# EAGLE design cyclops (EAGLE 7.5.0)
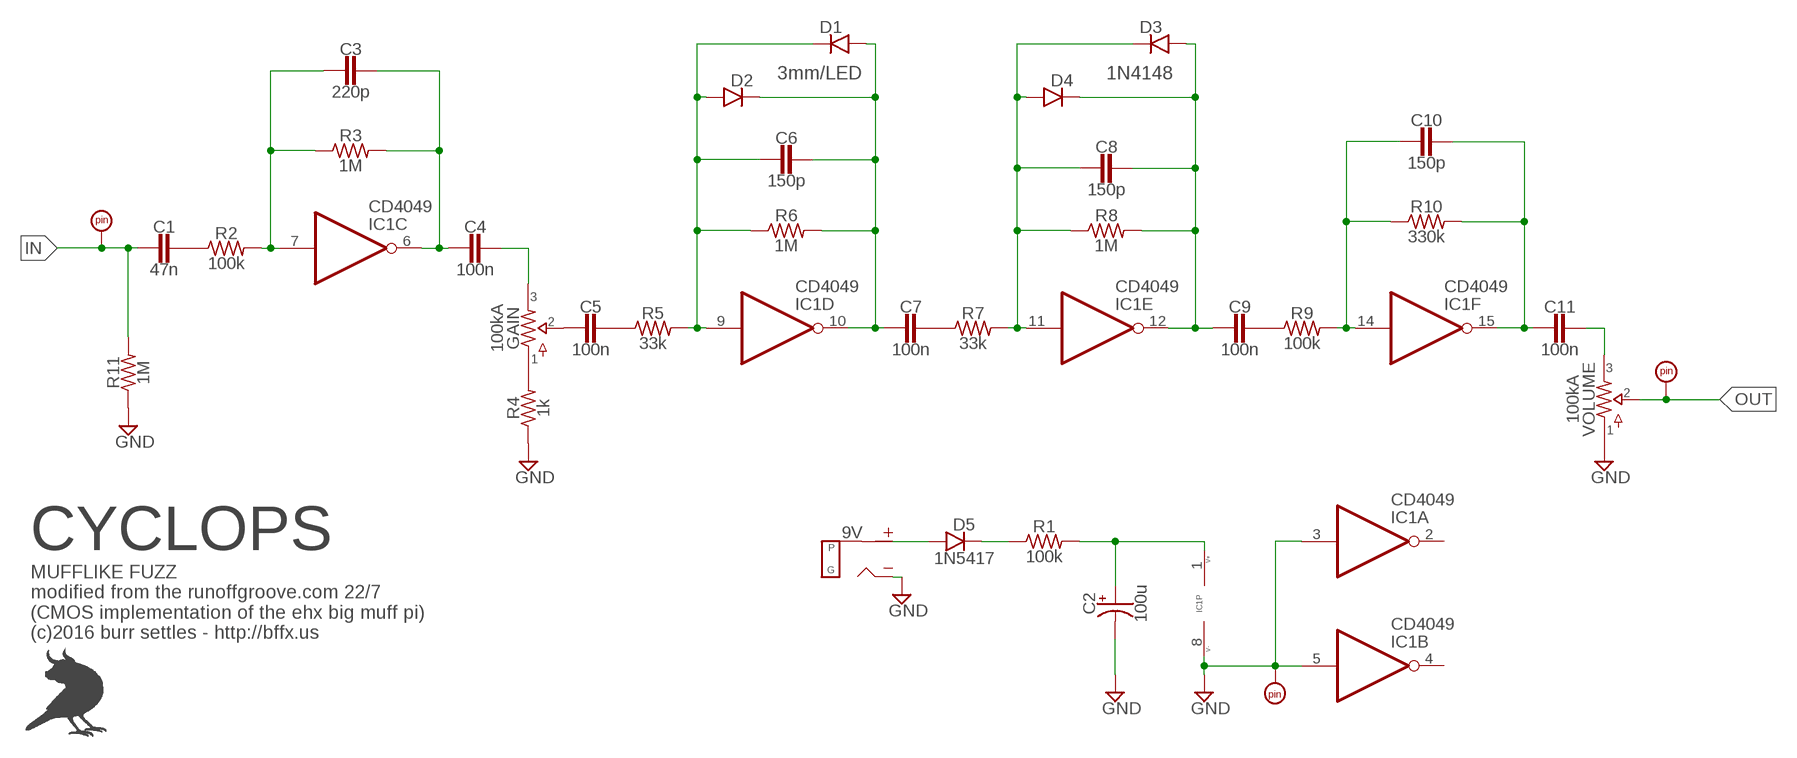
[diagram p0: schematic, sheet 1]

## Parts
9V  DC_MONO  [DC]
C1  47n  CER/FILM2  [050X030_025_2]
C2  100u  0631  [063_025]
C3  220p  CER/FILM2  [050X030_025_2]
C4  100n  CER/FILM2  [050X030_025_2]
C5  100n  CER/FILM2  [050X030_025_2]
C6  150p  CER/FILM2  [050X030_025_2]
C7  100n  CER/FILM2  [050X030_025_2]
C8  150p  CER/FILM2  [050X030_025_2]
C9  100n  CER/FILM2  [050X030_025_2]
C10  150p  CER/FILM2  [050X030_025_2]
C11  100n  CER/FILM2  [050X030_025_2]
D1  DO41.2  [DO41-2]
D2  DO41.2  [DO41-2]
D3  DO41.2  [DO41-2]
D4  DO41.2  [DO41-2]
D5  1N5417  DO41.3  [DO41-3]
GAIN  100kA  POTSTRIM  [2262_TRIM]
GND  PADRND  [ROUND]
IC1  CD4049  CD4049UBE  [DIL16]
IN  PADSQR  [SQUARE]
OUT  PADSQR  [SQUARE]
R1  100k  R_.2  [R0207/2V]
R2  100k  R_.2  [R0207/2V]
R3  1M  R_.2  [R0207/2V]
R4  1k  R_.2  [R0207/2V]
R5  33k  R_.2  [R0207/2V]
R6  1M  R_.2  [R0207/2V]
R7  33k  R_.2  [R0207/2V]
R8  1M  R_.2  [R0207/2V]
R9  100k  R_.2  [R0207/2V]
R10  330k  R_.2  [R0207/2V]
R11  1M  R_.2  [R0207/2V]
VOLUME  100kA  POTSSMALL_PADS  [PADS_SMALL]

## Nets
GND: 9V.S(SLEEVE) C2.- GND.1 IC1.3(A:I) IC1.5(B:I) IC1.8(P:VSS) R4.1 R11.1 VOLUME.1
IN: C1.2 IN.1 R11.2
N$1: C3.1 C4.2 IC1.6(C:O) R3.2
N$2: C5.2 GAIN.2
N$3: C3.2 IC1.7(C:I) R2.2 R3.1
N$4: C1.1 R2.1
N$5: C5.1 R5.1
N$6: C6.2 D1.C D2.A IC1.9(D:I) R5.2 R6.1
N$7: C6.1 C7.2 D1.A D2.C IC1.10(D:O) R6.2
N$8: C7.1 R7.1
N$9: C8.2 D3.C D4.A IC1.11(E:I) R7.2 R8.1
N$10: C4.1 GAIN.3
N$11: C8.1 C9.2 D3.A D4.C IC1.12(E:O) R8.2
N$12: C9.1 R9.1
N$13: C10.2 IC1.14(F:I) R9.2 R10.1
N$14: C10.1 C11.2 IC1.15(F:O) R10.2
N$15: GAIN.1 R4.2
N$16: C11.1 VOLUME.3
N$17: 9V.T(TIP) D5.A
N$18: C2.+ IC1.1(P:VDD) R1.2
N$21: D5.C R1.1
OUT: OUT.1 VOLUME.2
Unconnected: IC1.2(A:O) IC1.4(B:O)

## Notes on the sheet
- 3mm/LED | 1N4148
- CYCLOPS
- MUFFLIKE FUZZ
  modified from the runoffgroove.com 22/7
  (CMOS implementation of the ehx big muff pi)
  (c)2016 burr settles - http://bffx.us

## Library data of the parts
9V = jacks:DC_MONO
C1 C3-C11 = capacitors-film:CER/FILM: 47 - 120pF Xicon Ceramic Disc 2.5mm lead spacing
C2 = capacitors-elec:063: 33 - 220uF Xicon values at Mouser.com 10V: 220uF; 16V: 100uF; 25V: 100uF; 50V: 33uF
D1-D5 = diodes:DO41: DO-41 Package Diodes: 1N4001 - 1N40019 Zener Diodes: 1N4728 - 1N4764
GAIN VOLUME = potentiometers:POTS
GND IN OUT = supply pins:PAD
IC1 = integrated circuits:CD4049UBE: Hex Inverting Buffer Used, for example, in the Red Llama, Three Legged Dog, and Hot Harmonics.
R1-R11 = resistors:R_

## Board
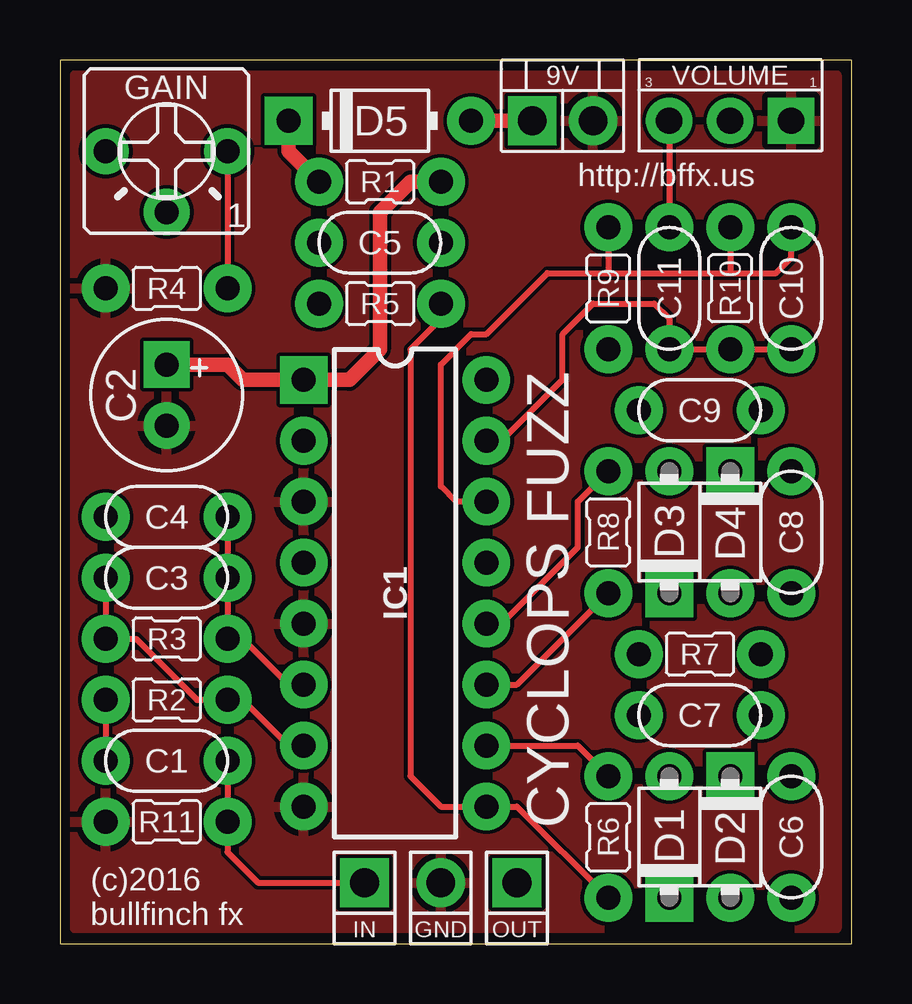
[diagram p1: board, top side]
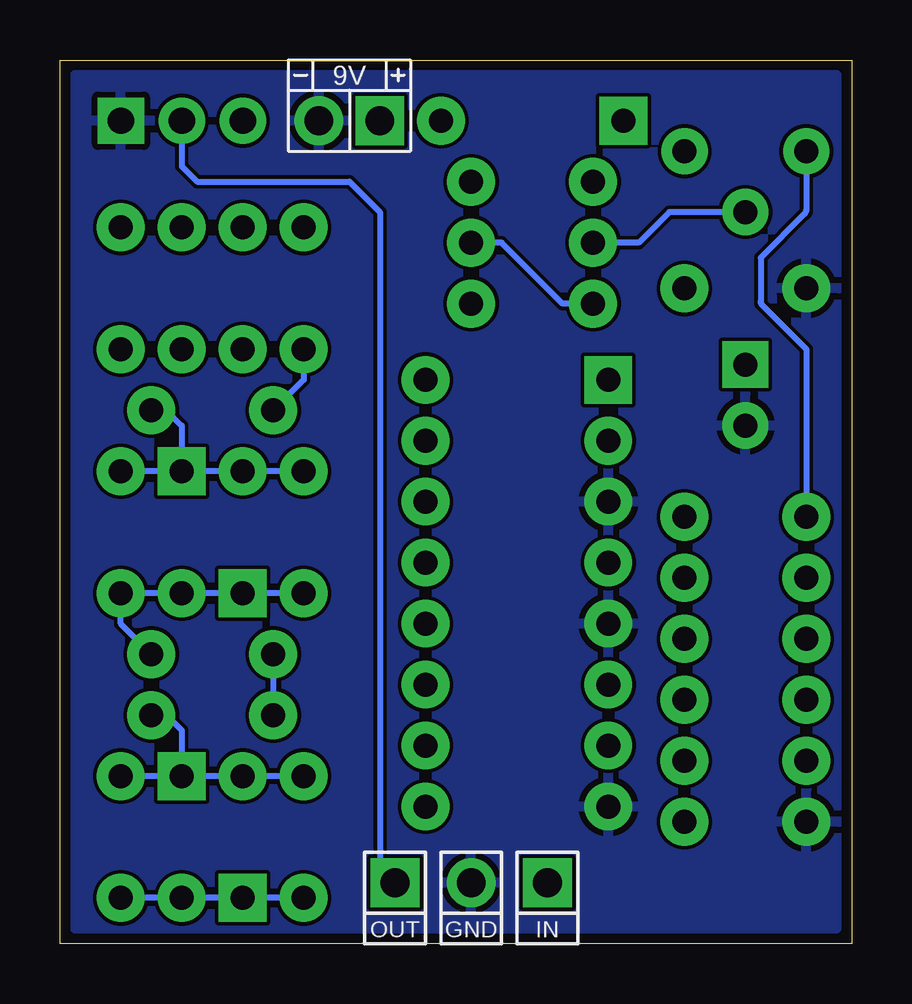
[diagram p2: board, bottom side, seen from below]

Size 33.02 x 36.82 mm. Coordinates in mm from the lower left corner, seen from the top.
Outline: 0,0 33.02,0 33.02,36.82 0,36.82 0,0
Copper layers (1*16): Top 0.0356mm / dielectric 1.5011mm / Bottom 0.0356mm
Design rules "oshpark-2layer": minimum track width 6mil, minimum drill 13mil, track to track 6mil, track to pad 6mil, pad to pad 6mil, via to via 6mil, smd to smd 6mil, copper to edge 15mil, drill to drill 6mil, minimum pad ring 7mil, minimum via ring 7mil, stop-mask expansion 2.5mil, vias tented up to drill 0mil, thermal gap 10mil

### Footprints (pad centres in the part's own frame; a part is rotated, then mirrored left to right if it is on the bottom)
DC = drill 1.2 pad 2.032: S -1.27,0 | drill 1.2 pad 2.032 square: T 1.27,0
050X030_025_2 = drill 1 pad 2: 1 -2.54,0; 2 2.54,0
063_025 = drill 1 pad 1.93 square: + -1.27,0 | drill 1 pad 1.93: - 1.27,0
DO41-2 = drill 1 pad 2: A 2.54,0 | drill 1 pad 2 square: C -2.54,0
DO41-3 = drill 1 pad 2: A 3.81,0 | drill 1 pad 2 square: C -3.81,0
2262_TRIM = drill 1 pad 1.93: 1 -2.54,0; 2 0,2.54; 3 2.54,0
ROUND = drill 1.2 pad 2.032: 1 0,0
DIL16 = drill 1 pad 1.981 square: 1 -8.89,-3.81 | drill 1 pad 1.981: 2 -6.35,-3.81; 3 -3.81,-3.81; 4 -1.27,-3.81; 5 1.27,-3.81; 6 3.81,-3.81; 7 6.35,-3.81; 8 8.89,-3.81; 9 8.89,3.81; 10 6.35,3.81; 11 3.81,3.81; 12 1.27,3.81; 13 -1.27,3.81; 14 -3.81,3.81; 15 -6.35,3.81; 16 -8.89,3.81
SQUARE = drill 1.2 pad 2.032 square: 1 0,0
R0207/2V = drill 1 pad 2: 1 -2.54,0; 2 2.54,0
PADS_SMALL = drill 1.1 pad 1.93 square: 1 2.54,0 | drill 1.1 pad 1.93: 2 0,0; 3 -2.54,0

### Placement (x,y rotation side)
9V  20.95,34.29 0 bottom
C1  4.45,7.62 0 top
C2  4.45,22.86 270 top
C3  4.45,15.24 180 top
C4  4.45,17.78 0 top
C5  13.34,29.21 180 top
C6  30.48,4.45 270 top
C7  26.67,9.53 0 top
C8  30.48,17.14 270 top
C9  26.67,22.23 0 top
C10  30.48,27.3 90 top
C11  25.4,27.3 270 top
D1  25.4,4.45 90 top
D2  27.94,4.45 270 top
D3  25.4,17.14 90 top
D4  27.94,17.14 270 top
D5  13.34,34.29 0 top
GAIN  4.45,33.02 180 top
GND  15.88,2.54 0 top
IC1  13.97,14.61 270 top
IN  12.7,2.54 0 top
OUT  19.05,2.54 0 top
R1  13.34,31.75 0 top
R2  4.45,10.16 0 top
R3  4.45,12.7 0 top
R4  4.45,27.3 0 top
R5  13.34,26.67 0 top
R6  22.86,4.45 90 top
R7  26.67,12.06 0 top
R8  22.86,17.14 90 top
R9  22.86,27.3 90 top
R10  27.94,27.3 270 top
R11  4.45,5.08 0 top
U$3  [BF0200]  19.05,29.84 0 top
VOLUME  27.94,34.29 0 top

### Tracks (layer width: path | path; a pad name or v marks a point on that pad's centre or on a via)
GND
  pour Top: 0.64,36.2 32.38,36.2 32.38,0.64 0.64,0.64
  pour Bottom: 0.64,36.2 32.38,36.2 32.38,0.64 0.64,0.64
IN
  Top 0.254: C1.2 R11.2 6.99,3.81 8.26,2.54 IN.1
N$1
  Top 0.254: C4.2 C3.1 R3.2 7.62,12.7 9.53,10.79 IC1.6
N$2
  Bottom 0.254: GAIN.2 7.62,30.48 8.89,29.21 C5.2
N$3
  Top 0.254: C3.2 R3.1 3.17,12.7 5.71,10.16 R2.2 7.62,10.16 9.53,8.26 IC1.7
N$4
  Top 0.254: R2.1 C1.1
N$5
  Bottom 0.254: R5.1 12.06,26.67 14.61,29.21 C5.1
N$6
  Top 0.254: R5.2 15.88,26.04 14.61,24.77 14.61,6.99 15.88,5.71 IC1.9 19.05,5.71 R6.1
  Bottom 0.254: R6.1 D1.C D2.A C6.2
N$7
  Top 0.254: IC1.10 21.59,8.26 R6.2
  Bottom 0.254: R6.2 D1.A D2.C | D2.C C6.1 | C7.2 28.57,9.53 27.94,8.89 D2.C
N$8
  Bottom 0.254: R7.1 C7.1
N$9
  Top 0.254: IC1.11 19.05,10.79 R8.1
  Bottom 0.254: R8.1 D3.C D4.A C8.2 30.48,13.34 R7.2
N$10
  Bottom 0.254: GAIN.3 1.91,30.59 arc45 1.98,30.41 3.81,28.57 3.81,26.77 arc-45 3.74,26.6 1.91,24.77 C4.1
N$11
  Top 0.254: IC1.12 18.41,13.34 21.59,16.51 21.59,18.41 R8.2
  Bottom 0.254: R8.2 D3.A D4.C | D4.C C8.1 | C9.2 28.57,22.23 27.94,21.59 D4.C
N$12
  Bottom 0.254: R9.1 22.86,23.5 C9.1
N$13
  Top 0.254: IC1.14 16.51,18.41 15.88,19.05 15.88,24.13 17.14,25.4 17.78,25.4 20.32,27.94 22.86,27.94 | 22.86,27.94 27.94,27.94 | 27.94,27.94 29.84,27.94 30.48,28.57 C10.2 | R9.2 22.86,27.94 | R10.1 27.94,27.94
N$14
  Top 0.254: IC1.15 18.41,20.95 20.95,23.5 20.95,25.4 22.23,26.67 24.77,26.67 25.4,26.04 C11.2 R10.2 C10.1
N$15
  Top 0.254: GAIN.1 R4.2
N$16
  Top 0.254: VOLUME.3 C11.1
N$17
  Top 0.61: 9V.T D5.A
N$18
  Top 0.61: R1.2 14.61,31.75 13.34,30.48 13.34,24.77 12.06,23.5 IC1.1 7.62,23.5 6.99,24.13 C2.+
N$21
  Top 0.61: D5.C 9.53,33.02 R1.1
OUT
  Bottom 0.254: VOLUME.2 27.94,32.38 27.3,31.75 20.95,31.75 19.68,30.48 19.68,3.28 arc-45 19.61,3.1 OUT.1

### Text on the board
tNames: http://bffx.us | CYCLOPS FUZZ | (c)2016 / bullfinch fx